# Altium project atmega_snippet.PrjPCB
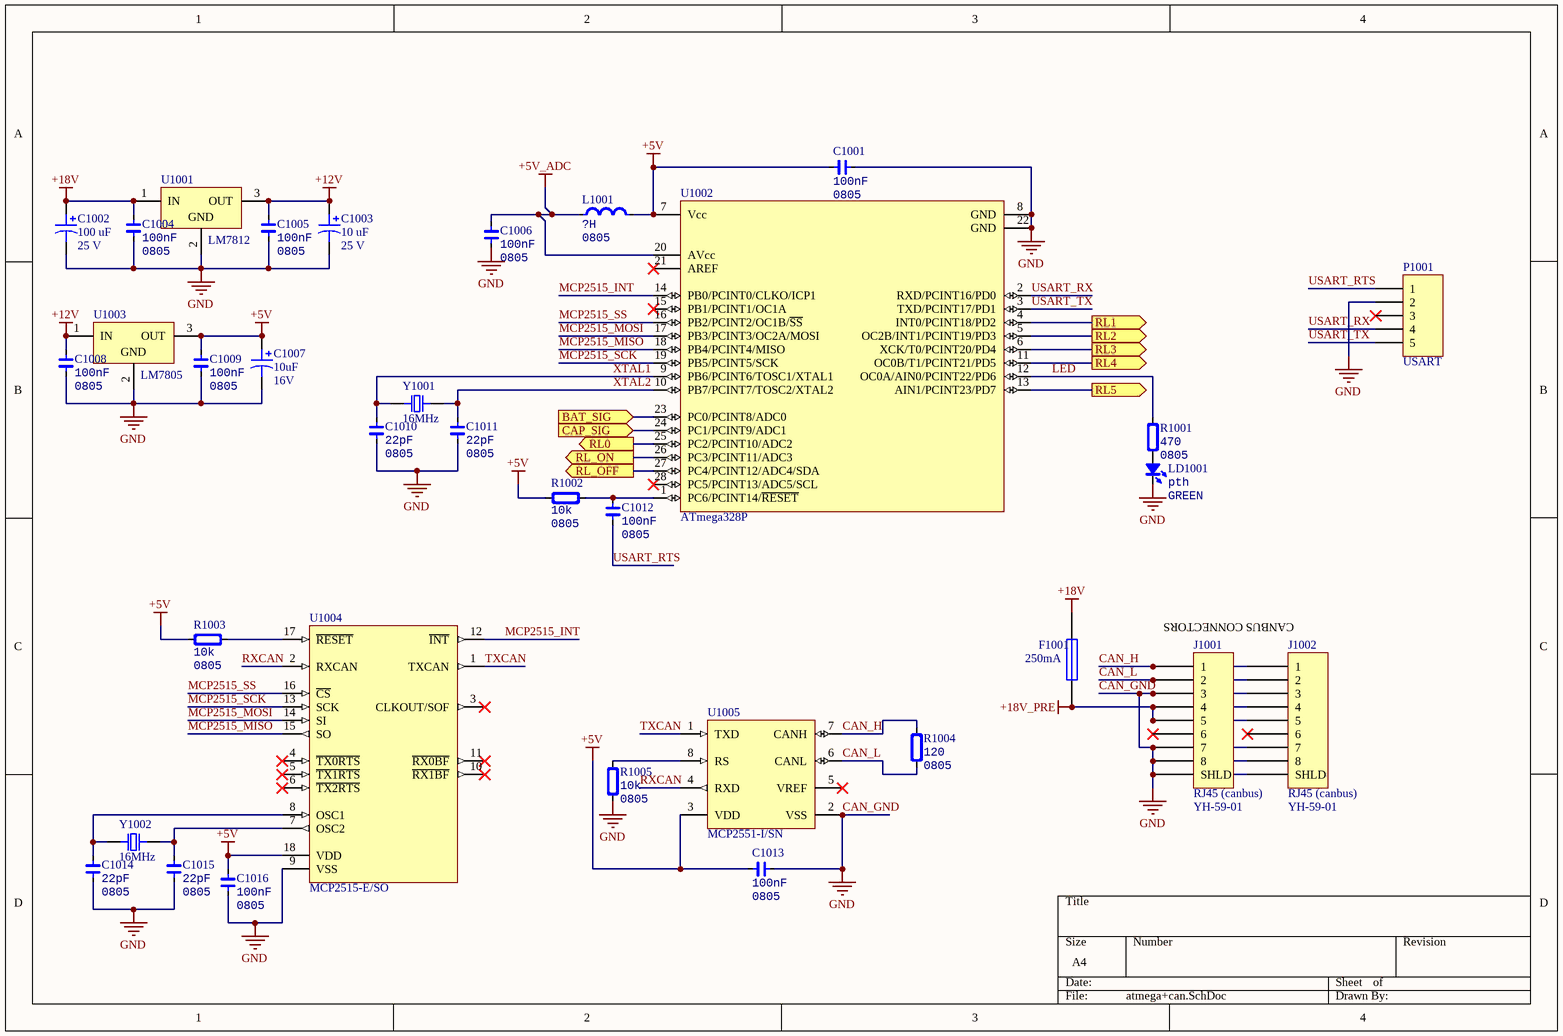
[diagram p0: atmega+can.SchDoc]
1 sheet, 34 parts. Net scope: flat (ports and power ports of the same name join across sheets).
Board file: atmega+can.PcbDoc

## Sheet atmega+can.SchDoc
size A4

### Parts
C1001  Type: 0805  [0805C]  (hidden comment: 100nF)
C1002  value 100 uF  Voltage: 25 V  [CP3.5mm-8.0mm]  (hidden comment: CapacitorPol)
C1003  value 10 uF  Voltage: 25 V  [CP3.5mm-8.0mm]  (hidden comment: CapacitorPol)
C1004  Type: 0805  [0805C]  (hidden comment: 100nF)
C1005  Type: 0805  [0805C]  (hidden comment: 100nF)
C1006  Type: 0805  [0805C]  (hidden comment: 100nF)
C1007  value 10uF  Voltage: 16V  [CP3.5mm-8.0mm]  (hidden comment: CapacitorPol)
C1008  Type: 0805  [0805C]  (hidden comment: 100nF)
C1009  Type: 0805  [0805C]  (hidden comment: 100nF)
C1010  Type: 0805  [0805C]  (hidden comment: 22pF)
C1011  Type: 0805  [0805C]  (hidden comment: 22pF)
C1012  Type: 0805  [0805C]  (hidden comment: 100nF)
C1013  Type: 0805  [0805C]  (hidden comment: 100nF)
C1014  Type: 0805  [0805C]  (hidden comment: 22pF)
C1015  Type: 0805  [0805C]  (hidden comment: 22pF)
C1016  Type: 0805  [0805C]  (hidden comment: 100nF)
F1001  250mA  [Porta Fusivel]
J1001  RJ45 (canbus)  value YH-59-01  [ASSMANN A-2004-2-4-LP/FS]
J1002  RJ45 (canbus)  value YH-59-01  [ASSMANN A-2004-2-4-LP/FS]
L1001  Type: 0805  [0805I]  (hidden comment: ?H)
LD1001  Type: pth  [LED3MM]  (hidden comment: GREEN)
P1001  USART  [HDR1X5]
R1001  Type: 0805  [0805C]  (hidden comment: 470)
R1002  Type: 0805  [0805C]  (hidden comment: 10k)
R1003  Type: 0805  [0805C]  (hidden comment: 10k)
R1004  Type: 0805  [0805C]  (hidden comment: 120)
R1005  Type: 0805  [0805C]  (hidden comment: 10k)
U1001  LM7812  [TO220_deitado]
U1002  ATmega328P  [DIP28-300(100)]
U1003  LM7805  [TO220_deitado]
U1004  MCP2515-E/SO  [WSO18_L]
U1005  MCP2551-I/SN  [SOIC08-150(50)]
Y1001  16MHz  [HC49-US-THT]
Y1002  16MHz  [HC49-US-THT]

### Ports
BAT_SIG (in), CAP_SIG (in), RL0 (out), RL1 (out), RL2 (out), RL3 (out), RL4 (out), RL5 (out), RL_OFF (out), RL_ON (out)

### Nets
+5V: C1001.1 C1007.1 C1009.2 C1013.1 C1016.1 L1001.2 R1002.1 R1003.1 U1002.7(Vcc) U1003.3(OUT) U1004.18(VDD) U1005.3(VDD)
+5V_ADC: C1006.2 L1001.1 U1002.20(AVcc)
+12V: C1003.1 C1005.2 C1008.2 U1001.3(OUT) U1003.1(IN)
+18V: C1002.1 C1004.2 F1001.1 U1001.1(IN)
+18V_PRE: F1001.2 J1001.4 J1001.5 J1002.4 J1002.5
CAN_GND: C1001.2 C1002.2 C1003.2 C1004.1 C1005.1 C1006.1 C1007.2 C1008.1 C1009.1 C1010.1 C1011.1 C1013.2 C1014.1 C1015.1 C1016.2 J1001.3 J1001.7 J1001.8 J1001.S(SHLD) J1002.3 J1002.7 J1002.8 J1002.S(SHLD) LD1001.2(K) P1001.2 R1005.2 U1001.2(GND) U1002.8(GND) U1002.22(GND) U1003.2(GND) U1004.9(VSS) U1005.2(VSS)  [also labelled GND]
CAN_H: J1001.1 J1002.1 R1004.2 U1005.7(CANH)
CAN_L: J1001.2 J1002.2 R1004.1 U1005.6(CANL)
LED: R1001.2 U1002.12(OC0A/AIN0/PCINT22/PD6)
MCP2515_INT: U1002.14(PB0/PCINT0/CLKO/ICP1) U1004.12(~{INT})
MCP2515_MISO: U1002.18(PB4/PCINT4/MISO) U1004.15(SO)
MCP2515_MOSI: U1002.17(PB3/PCINT3/OC2A/MOSI) U1004.14(SI)
MCP2515_SCK: U1002.19(PB5/PCINT5/SCK) U1004.13(SCK)
MCP2515_SS: U1002.16(PB2/PCINT2/OC1B/~{SS}) U1004.16(~{CS})
RXCAN: U1004.2(RXCAN) U1005.4(RXD)
TXCAN: U1004.1(TXCAN) U1005.1(TXD)
USART_RTS: C1012.2 P1001.1
USART_RX: P1001.4 U1002.2(RXD/PCINT16/PD0)
USART_TX: P1001.5 U1002.3(TXD/PCINT17/PD1)
XTAL1: C1010.2 U1002.9(PB6/PCINT6/TOSC1/XTAL1) Y1001.1
XTAL2: C1011.2 U1002.10(PB7/PCINT7/TOSC2/XTAL2) Y1001.2
NetC1012_1: C1012.1 R1002.2 U1002.1(PC6/PCINT14/~{RESET})
NetC1014_2: C1014.2 U1004.8(OSC1) Y1002.1
NetC1015_2: C1015.2 U1004.7(OSC2) Y1002.2
NetLD1001_1: LD1001.1(A) R1001.1
NetR1003_2: R1003.2 U1004.17(~{RESET})
NetR1005_1: R1005.1 U1005.8(RS)
NetU1002_4: U1002.4(INT0/PCINT18/PD2) ; port RL1
NetU1002_5: U1002.5(OC2B/INT1/PCINT19/PD3) ; port RL2
NetU1002_6: U1002.6(XCK/T0/PCINT20/PD4) ; port RL3
NetU1002_11: U1002.11(OC0B/T1/PCINT21/PD5) ; port RL4
NetU1002_13: U1002.13(AIN1/PCINT23/PD7) ; port RL5
NetU1002_23: U1002.23(PC0/PCINT8/ADC0) ; port BAT_SIG
NetU1002_24: U1002.24(PC1/PCINT9/ADC1) ; port CAP_SIG
NetU1002_25: U1002.25(PC2/PCINT10/ADC2) ; port RL0
NetU1002_26: U1002.26(PC3/PCINT11/ADC3) ; port RL_ON
NetU1002_27: U1002.27(PC4/PCINT12/ADC4/SDA) ; port RL_OFF

Not connected (* = marked no-connect by the designer): J1001 6*; J1002 6*; P1001 3*; U1002 15(PB1/PCINT1/OC1A)* 21(AREF)* 28(PC5/PCINT13/ADC5/SCL)*; U1004 3(CLKOUT/SOF)* 4(~{TX0RTS})* 5(~{TX1RTS})* 6(~{TX2RTS})* 10(~{RX1BF})* 11(~{RX0BF})*; U1005 5(VREF)*

### Notes on the sheet
- CANBUS CONNECTORS

### Library data of the parts
C1001 C1004-C1006 C1008-C1016 = Cap_0805: Capacitor
  C1001 C1004-C1006 C1008 C1009 C1012 C1013 C1016: Value: 100nF
  C1010 C1011 C1014 C1015: Value: 22pF
C1002 C1003 C1007 = CapacitorPol: Solid Aluminum Capacitor with Organic Semiconductor Electrolyte: 100uF, 10V, Bulk Pack; PackageReference: E
F1001 = Fuse 1: Fuse; LatestRevisionNote: Re-released for DXP Platform.; PackageReference: PIN-W2/E2.8
J1001 J1002 = Modular Jack with Shield: YH-59-01
L1001 = Ind_0805: Inductor; Value: ?H
LD1001 = LED_0805: LED; Value: GREEN
P1001 = Header 5: Header, 5-Pin; LatestRevisionNote: Re-released for DXP Platform.
R1001-R1005 = Res_0805: Resistor
  R1001: Value: 470
  R1002 R1003 R1005: Value: 10k
  R1004: Value: 120
U1001 U1003 = µA7805CKC: Positive-Voltage Regulator; PackageReference: KC03
U1002 = ATmega328P: 8-bit AVR Microcontroller, 32KB Flash, 1KB EEPROM, 2KB SRAM, 28-pin PDIP, Industrial Grade (-40°C to 85°C); PackageReference: 28P3
U1004 = CMP-0186-00035-2: Stand-Alone CAN Controller With SPI Interface, 18-Pin SOIC, Extended Temperature; PackageReference: SOIC-SO18
U1005 = CMP-1721-00003-1: High-Speed CAN Transceiver, / 1 Mb/s, 4.5 to 5.5 V, 8-Pin SOIC (SN), Industrial Temperature, RoHS, Tube; PackageReference: SN8
Y1001 Y1002 = Crystal